# Altium schematic sheet VGA_driver.SchDoc
size A4; SheetNumber: 4; SheetTotal: 4
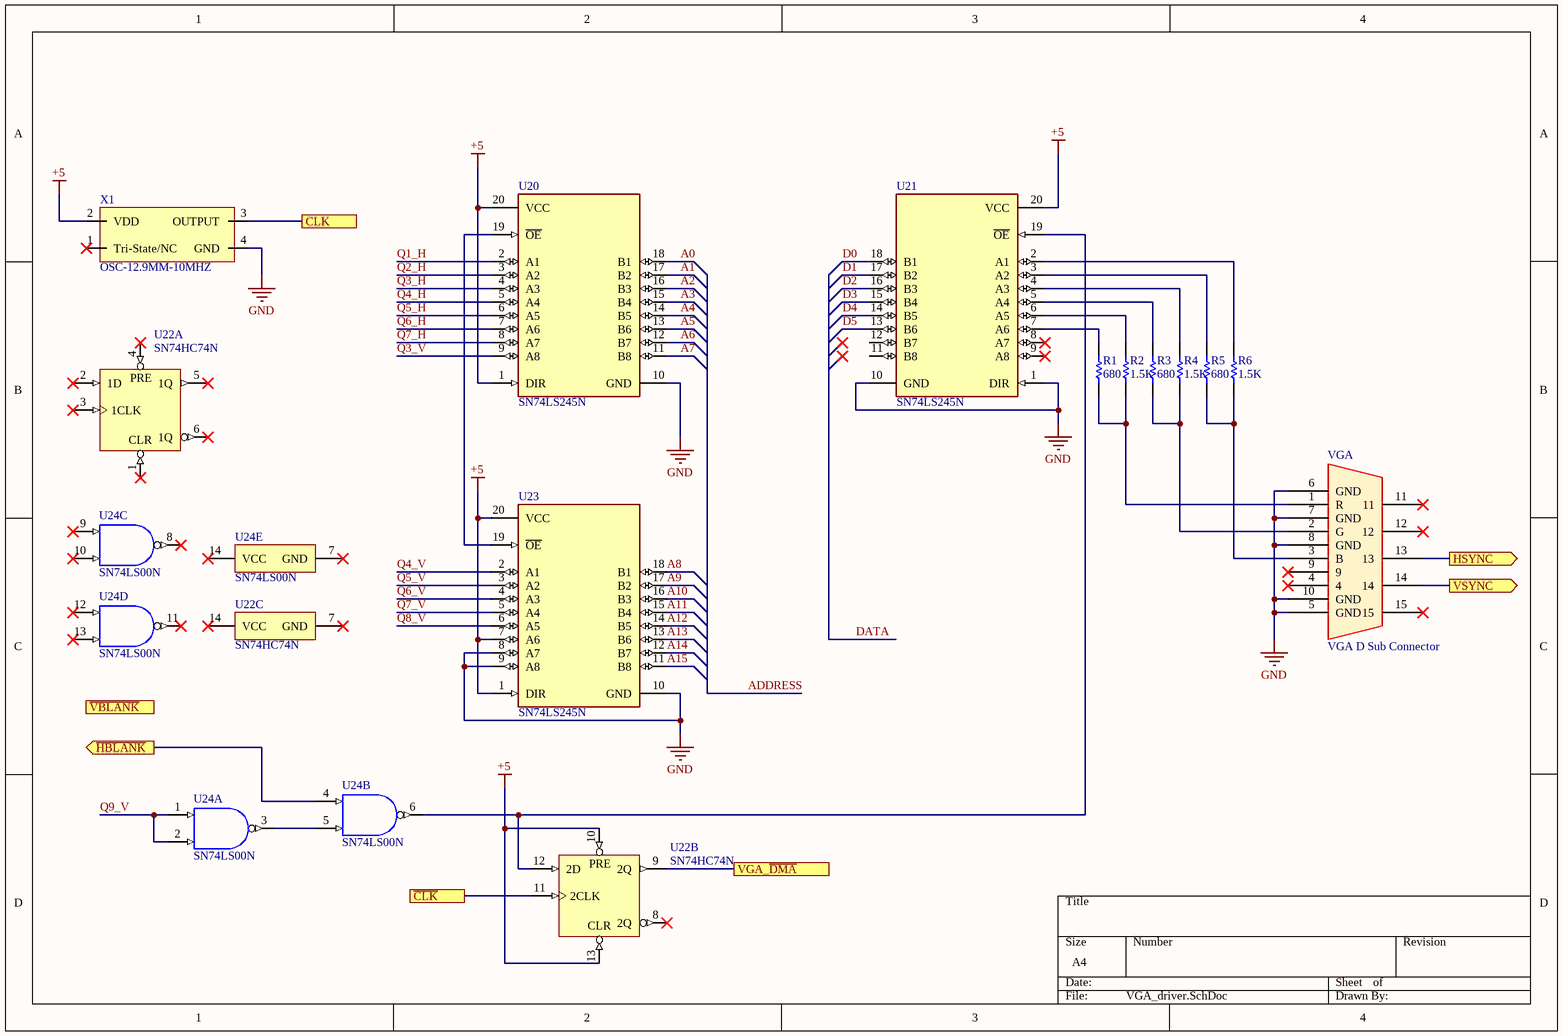
[diagram p0: VGA_driver.SchDoc]

## Parts
R1  Resistance: 680  [RESC2013X50X30NL20T20]  (hidden comment: CRCW0805680RFKEA)
R2  Resistance: 1.5K  [RESC2013X60X35LL10T20]  (hidden comment: RC0805FR-071K5L)
R3  Resistance: 680  [RESC2013X50X30NL20T20]  (hidden comment: CRCW0805680RFKEA)
R4  Resistance: 1.5K  [RESC2013X60X35LL10T20]  (hidden comment: RC0805FR-071K5L)
R5  Resistance: 680  [RESC2013X50X30NL20T20]  (hidden comment: CRCW0805680RFKEA)
R6  Resistance: 1.5K  [RESC2013X60X35LL10T20]  (hidden comment: RC0805FR-071K5L)
U20  SN74LS245N  [FP-N0020A-MFG]
U21  SN74LS245N  [FP-N0020A-MFG]
U22  SN74HC74N  [N0014A]  (parts A,B,C of 3)
U23  SN74LS245N  [FP-N0020A-MFG]
U24  SN74LS00N  [N0014A]  (parts A,B,C,D,E of 5)
VGA  VGA D Sub Connector  [VGA]
X1  OSC-12.9MM-10MHZ  [OSC_THT_12-9MM]

## Ports
CLK, HSYNC (out), VGA_~{DMA}, VSYNC (out), ~{CLK}, ~{HBLANK} (out), ~{VBLANK} (in)

## Nets
+5: U20.1(DIR) U20.20(VCC) U21.20(VCC) U22.10(2~{PRE}) U22.13(2~{CLR}) U23.1(DIR) U23.7(A6) U23.20(VCC) X1.2(VDD)
GND: U20.10(GND) U21.1(DIR) U21.10(GND) U23.8(A7) U23.9(A8) U23.10(GND) VGA.5(GND) VGA.6(GND) VGA.7(GND) VGA.8(GND) VGA.10(GND) X1.4(GND)
A0: U20.18(B1)
A1: U20.17(B2)
A2: U20.16(B3)
A3: U20.15(B4)
A4: U20.14(B5)
A5: U20.13(B6)
A6: U20.12(B7)
A7: U20.11(B8)
A8: U23.18(B1)
A9: U23.17(B2)
A10: U23.16(B3)
A11: U23.15(B4)
A12: U23.14(B5)
A13: U23.13(B6)
A14: U23.12(B7)
A15: U23.11(B8)
~{CLK}: U22.11(2CLK) ; port ~{CLK}
CLK: X1.3(OUTPUT) ; port CLK
D0: U21.18(B1)
D1: U21.17(B2)
D2: U21.16(B3)
D3: U21.15(B4)
D4: U21.14(B5)
D5: U21.13(B6)
~{HBLANK}: U24.4(2A) ; port ~{HBLANK}
HSYNC: VGA.13 ; port HSYNC
Q1_H: U20.2(A1)
Q2_H: U20.3(A2)
Q3_H: U20.4(A3)
Q3_V: U20.9(A8)
Q4_H: U20.5(A4)
Q4_V: U23.2(A1)
Q5_H: U20.6(A5)
Q5_V: U23.3(A2)
Q6_H: U20.7(A6)
Q6_V: U23.4(A3)
Q7_H: U20.8(A7)
Q7_V: U23.5(A4)
Q8_V: U23.6(A5)
Q9_V: U24.1(1A) U24.2(1B)
VGA_~{DMA}: U22.9(2Q) ; port VGA_~{DMA}
VSYNC: VGA.14 ; port VSYNC
NetR1_1: R1.1 R2.1 VGA.1(R)
NetR1_2: R1.2 U21.7(A6)
NetR2_2: R2.2 U21.6(A5)
NetR3_1: R3.1 R4.1 VGA.2(G)
NetR3_2: R3.2 U21.5(A4)
NetR4_2: R4.2 U21.4(A3)
NetR5_1: R5.1 R6.1 VGA.3(B)
NetR5_2: R5.2 U21.3(A2)
NetR6_2: R6.2 U21.2(A1)
NetU20_19: U20.19(~{OE}) U23.19(~{OE})
NetU21_19: U21.19(~{OE}) U22.12(2D) U24.6(2Y)
NetU24_3: U24.3(1Y) U24.5(2B)

Not connected (* = marked no-connect by the designer): U21 8(A7)* 9(A8)* 11(B8) 12(B7); U22 1(1~{CLR})* 2(1D)* 3(1CLK)* 4(1~{PRE})* 5(1Q)* 6(1Q)* 7(GND)* 8(2Q)* 14(VCC)*; U24 7(GND)* 8(3Y)* 9(3A)* 10(3B)* 11(4Y)* 12(4A)* 13(4B)* 14(VCC)*; VGA 4* 9* 11* 12* 15*; X1 1(Tri-State/NC)*

## Buses and harness runs
bus ADDRESS
bus DATA

## Notes on the sheet
- (in symbol CMP-1616-00096-3, part A) PRE; CLR
- (in symbol CMP-1616-00096-3, part B) PRE; CLR

## Library data of the parts
R1 R3 R5 = CMP-2001-04066-1: Manufacturer: Vishay Dale; Part Number: CRCW0805680RFKEA
R2 R4 R6 = CMP-1659-00010-2: RES 1.50K OHM 1/8W 1% 0805 SMD; Manufacturer: Yageo; PackageReference: 0805; ComponentLink1URL: http://www.yageo.com/documents/recent/PYu-RC_Group_51_RoHS_L_04.pdf; ComponentLink1Description: Datasheet; PartNumber: RC0805FR-071K5L
U20 U21 U23 = CMP-1620-00419-3: IC TXRX NON-INVERT 5.25V 20DIP; Number of Bits per Element: 8; Polarity: Non-Inverting; Low Level Output Current: 24mA; Propagation Delay: 12ns; Min Supply Voltage: 4.75V; Number of Elements: 1; Quiescent Current: 62mA; Logic Function: Transceiver; Direction: Bidirectional; Operating Supply Voltage: 5V; High Level Output Current: -15mA; Mount: Through Hole; Min Operating Temperature: 0°C; Number of Outputs: 8; Max Operating Temperature: 70°C; Max Supply Voltage: 5.25V; Width: 6.35mm; Number of Pins: 20; RoHS Compliant: Yes; Turn-On Delay Time: 12ns; Termination: Through Hole; Number of Channels: 8; Number of Circuits: 8; Weight: 0.042297oz; Package Quantity: 20; Number of Transceivers: 8; Length: 24.33mm; Height: 4.57mm; REACH SVHC: No SVHC; Contact Plating: Gold; Number of Bits: 8; Lead Free: Lead Free; Case/Package: PDIP; Packaging: Rail/Tube; Radiation Hardening: No
U22 = CMP-1616-00096-3: Dual D-Type Positive-Edge-Triggered Flip-Flops With Clear and Preset, N0014A, TUBE; Manufacturer: Texas Instruments; VCC(Min)(V): 2; F @ Nom Voltage(Max)(Mhz): 28; Voltage(Nom)(V): 3.3,5; Output Drive (IOL/IOH)(Max)(mA): 5.2/-5.2; Output: 3S; ICC @ Nom Voltage(Max)(mA): 0.04; Output Logic: Inverted,Non-inverted; Technology Family: HC; 3-State Output: No; VCC(Max)(V): 6; Output Type: CMOS; tpd @ Nom Voltage(Max)(ns): 37; Rating: Catalog; Operating Temperature Range(C): -40 to 85; DatasheetVersion: SCLS094D; Code_JEDEC: MS-001; Bits(#): 2; Schmitt Trigger: No; PackageReference: N0014A; Generic Part Number: SN74HC74; Input Type: CMOS
U24 = CMP-1627-00476-2: Quad 2-input positive-NAND gates, N0014A, TUBE; Manufacturer: Texas Instruments; VCC(Min)(V): 4.75; F @ Nom Voltage(Max)(Mhz): 35; Voltage(Nom)(V): 5; Rating: Catalog; tpd @ Nom Voltage(Max)(ns): 22; Output Type: TTL; Schmitt Trigger: No; Output Drive (IOL/IOH)(Max)(mA): 0.4/-16; Technology Family: LS; ICC @ Nom Voltage(Max)(mA): 0.022; VCC(Max)(V): 5.25; Bits(#): 4; Code_JEDEC: MS-001; Generic Part Number: SN74LS00; Input Type: TTL; Operating Temperature Range(C): 0 to 70; PackageReference: N0014A; DatasheetVersion: SDLS025B
VGA = VGA-002
X1 = OSC-12.9MM-1MHZ: 12.9MM x 12.9MM, 1MHz Can Oscillator